# Altium schematic sheet multilayer.SchDoc
size A4; SheetNumber: 1; SheetTotal: 1
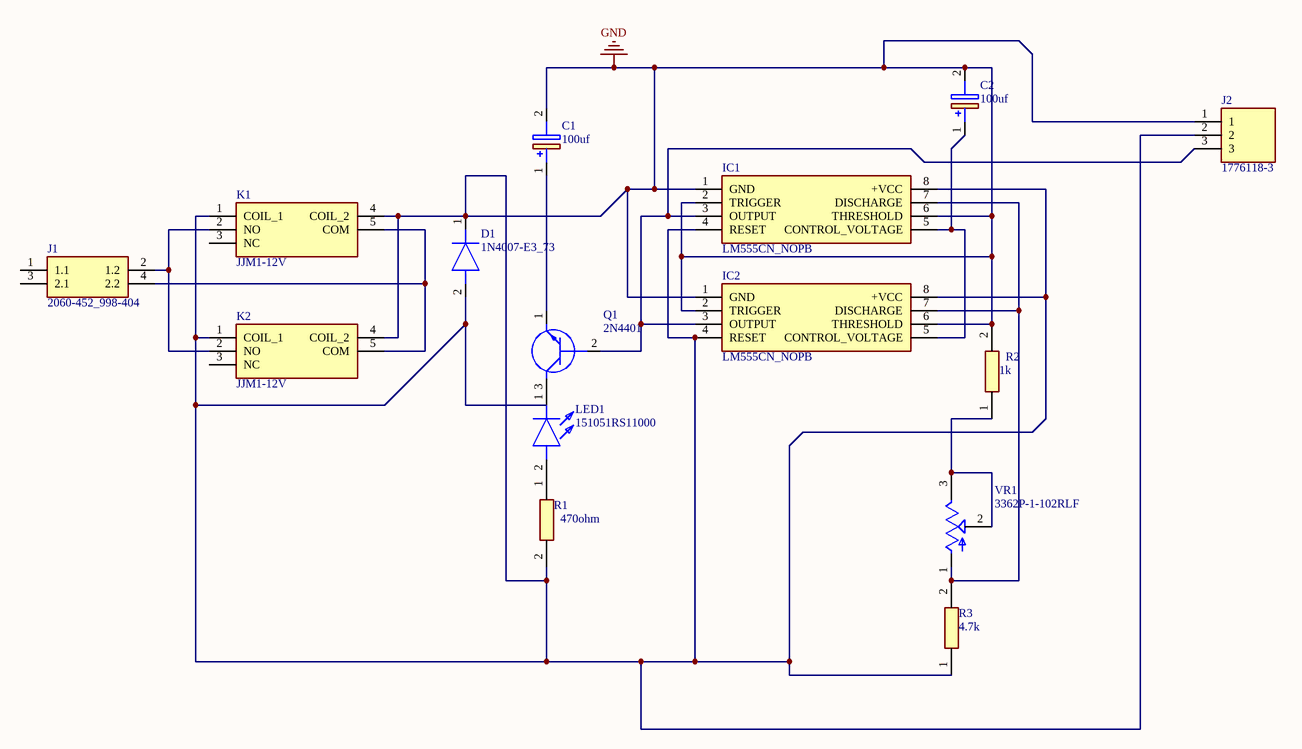
[diagram p0: multilayer.SchDoc]

## Parts
C1  100uf  [CAPPRD500W65D1000H3200]
C2  100uf  [CAPPRD500W65D1000H3200]
D1  1N4007-E3_73  [DIOAD1405W86L465D235]
IC1  LM555CN_NOPB  [DIP794W53P254L959H508Q8N]
IC2  LM555CN_NOPB  [DIP794W53P254L959H508Q8N]
J1  2060-452_998-404  [2060452998404]
J2  1776118-3  [TE_1776118-3]
K1  JJM1-12V  [JJM112V]
K2  JJM1-12V  [JJM112V]
LED1  151051RS11000  [151051RS11000]
Q1  2N4401  [CS_TO-92]
R1  470ohm  [RESAD1987W56L1031D239]
R2  1k  [RESAD1987W56L1031D239]
R3  4.7k  [RESAD1987W56L1031D239]
VR1  3362P-1-102RLF  [TRIM_3362P-1-102RLF]

## Nets
GND: C1.2(-) C2.2(-) D1.1(K) D1.2(A) IC1.1(GND) IC1.2(TRIGGER) IC1.4(RESET) IC1.6(THRESHOLD) IC1.8(+VCC) IC2.1(GND) IC2.2(TRIGGER) IC2.4(RESET) IC2.6(THRESHOLD) IC2.8(+VCC) J2.1 J2.2 K1.1(COIL_1) K1.4(COIL_2) K2.1(COIL_1) K2.4(COIL_2) R1.2 R2.2 R3.1
NetC1_1: C1.1(+) Q1.1(E)
NetC2_1: C2.1(+) IC1.5(CONTROL_VOLTAGE) IC2.5(CONTROL_VOLTAGE)
NetIC1_3: IC1.3(OUTPUT) IC2.3(OUTPUT) J2.3 Q1.2(B)
NetIC1_7: IC1.7(DISCHARGE) IC2.7(DISCHARGE) R3.2 VR1.1(CCW)
NetJ1_2: J1.2(1.2) K1.2(NO) K2.2(NO)
NetJ1_4: J1.4(2.2) K1.5(COM) K2.5(COM)
NetLED1_1: LED1.1(K) Q1.3(C)
NetLED1_2: LED1.2(A) R1.1
NetR2_1: R2.1 VR1.2(WIPER) VR1.3(CW)

Not connected (* = marked no-connect by the designer): J1 1(1.1) 3(2.1); K1 3(NC); K2 3(NC)

## Library data of the parts
C1 C2 = EEU-FC2A101L: Capacitor Polarised; Manufacturer_Name: Panasonic; Datasheet Link: http://industrial.panasonic.com/cdbs/www-data/pdf/RDF0000/ABA0000C1209.pdf; Height: 32mm; Manufacturer_Part_Number: EEU-FC2A101L; Mouser Part Number: 667-EEU-FC2A101L; Mouser Price/Stock: https://www.mouser.co.uk/ProductDetail/Panasonic/EEU-FC2A101L?qs=MtOUKumLmnYYrYsMGpDvcw%3D%3D; Arrow Part Number: EEU-FC2A101L; Arrow Price/Stock: https://www.arrow.com/en/products/eeu-fc2a101l/panasonic?region=nac
D1 = 1N4007-E3_73: Diode; Manufacturer_Name: Vishay; Manufacturer_Part_Number: 1N4007-E3/73; Datasheet Link: https://mouser.componentsearchengine.com/Datasheets/2/1N4007-E3_73.pdf; Mouser Part Number: 625-1N4007-E3/73; Mouser Price/Stock: https://www.mouser.co.uk/ProductDetail/Vishay-General-Semiconductor/1N4007-E3-73?qs=N4vtoAxH%2FSqT3Ng3e4K0Gw%3D%3D; Arrow Part Number: 1N4007-E3/73; Arrow Price/Stock: https://www.arrow.com/en/products/1n4007-e373/vishay?region=europe
IC1 IC2 = LM555CN_NOPB: Integrated Circuit; Manufacturer_Name: Texas Instruments; Manufacturer_Part_Number: LM555CN/NOPB; Datasheet Link: https://datasheet.datasheetarchive.com/originals/distributors/Datasheets-SFU2/DSASFU100035550.pdf; Height: 5.08mm; Mouser Part Number: 926-LM555CN/NOPB; Mouser Price/Stock: https://www.mouser.co.uk/ProductDetail/Texas-Instruments/LM555CN-NOPB?qs=QbsRYf82W3GjZpQL%2FakZOg%3D%3D; Arrow Part Number: LM555CN/NOPB; Arrow Price/Stock: https://www.arrow.com/en/products/lm555cnnopb/texas-instruments?region=nac
J1 = 2060-452_998-404: Connector; Manufacturer_Name: Wago; Manufacturer_Part_Number: 2060-452/998-404; Datasheet Link: https://www.wago.com/2060-452/998-404; Height: 4.5mm; Arrow Part Number: 2060-452/998-404; Arrow Price/Stock: https://www.arrow.com/en/products/2060-452998-404/wago-kontakttechnik-gmbh?region=nac
J2 = 1776118-3: Conn Terminal Block F 3 POS 5mm Solder ST Thru-Hole Package; MF: TE Connectivity; Price: None; Availability: In Stock; MP: 1776118-3; Package: None; SnapEDA_Link: https://www.snapeda.com/parts/1776118-3/TE+Connectivity+AMP+Connectors/view-part/?ref=snap; Check_prices: https://www.snapeda.com/parts/1776118-3/TE+Connectivity+AMP+Connectors/view-part/?ref=eda; Value: *; EU_RoHS_Compliance: Compliant with Exemptions; Purchase-URL: https://pricing.snapeda.com/search/part/1776118-3/?ref=eda
K1 K2 = JJM1-12V: Relay or Contactor; Manufacturer_Name: Panasonic; Datasheet Link: https://www.panasonic-electric-works.com/cps/rde/xbcr/pew_eu_en/ds_61210_en_jjm.pdf; Height: 14.2mm; Manufacturer_Part_Number: JJM1-12V; Mouser Part Number: 769-JJM1-12V; Mouser Price/Stock: https://www.mouser.co.uk/ProductDetail/Panasonic-Industrial-Devices/JJM1-12V?qs=UO%2Fx91QLkSB08I34A9%2FECg%3D%3D; Arrow Part Number: JJM1-12V; Arrow Price/Stock: https://www.arrow.com/en/products/jjm1-12v/panasonic?region=nac
LED1 = 151051RS11000: LED; Manufacturer_Name: Wurth Elektronik; Datasheet Link: https://katalog.we-online.com/led/datasheet/151051RS11000.pdf; Height: 13.6mm; Manufacturer_Part_Number: 151051RS11000; Mouser Part Number: 710-151051RS11000; Mouser Price/Stock: https://www.mouser.co.uk/ProductDetail/Wurth-Elektronik/151051RS11000?qs=LlUlMxKIyB0NuMCRBgVmEg%3D%3D
Q1 = 2N4401: Transistor BJT NPN; Manufacturer_Name: Central Semiconductor; Datasheet Link: https://my.centralsemi.com/get_document.php?cmp=1&mergetype=pd&mergepath=pd&pdf_id=2N4400.PDF; Manufacturer_Part_Number: 2N4401; Mouser Part Number: 610-2N4401; Mouser Price/Stock: https://www.mouser.com/Search/Refine.aspx?Keyword=610-2N4401
R1-R3 = RS01A1R000FE12: Resistor; Manufacturer_Name: Vishay; Datasheet Link: http://www.mouser.com/ds/2/427/rsns-226497.pdf; Manufacturer_Part_Number: RS01A1R000FE12; Mouser Part Number: 71-RS01A1R000FE12; Mouser Price/Stock: https://www.mouser.co.uk/ProductDetail/Vishay-Dale/RS01A1R000FE12?qs=pX8%252BLszEE6SqU%2F4VU%252B6gEw%3D%3D; Arrow Part Number: RS01A1R000FE12; Arrow Price/Stock: https://www.arrow.com/en/products/rs01a1r000fe12/vishay?region=nac
VR1 = 3362P-1-102RLF: 1 kOhms 0.5W, 1/2W PC Pins Through Hole Trimmer Potentiometer Cermet 1 Turn Top Adjustment; MF: Bourns; Value: *; Check_prices: https://www.snapeda.com/parts/3362P-1-102RLF/Bourns/view-part/1439351/?ref=eda; Availability: Good; Package: 3362P-1 Bourns Inc.; SnapEDA_Link: https://www.snapeda.com/parts/3362P-1-102RLF/Bourns/view-part/1439351/?ref=snap; Purchase-URL: https://pricing.snapeda.com/search/part/3362P-1-102RLF/?ref=eda; Price: None; MP: 3362P-1-102RLF